# EasyEDA schematic optiDrive_Shematic.json
TITLE: STM32 Blue Pill closed stepper controller; REV: 0.1; Date: 2021-12-12; Sheet: 1/1
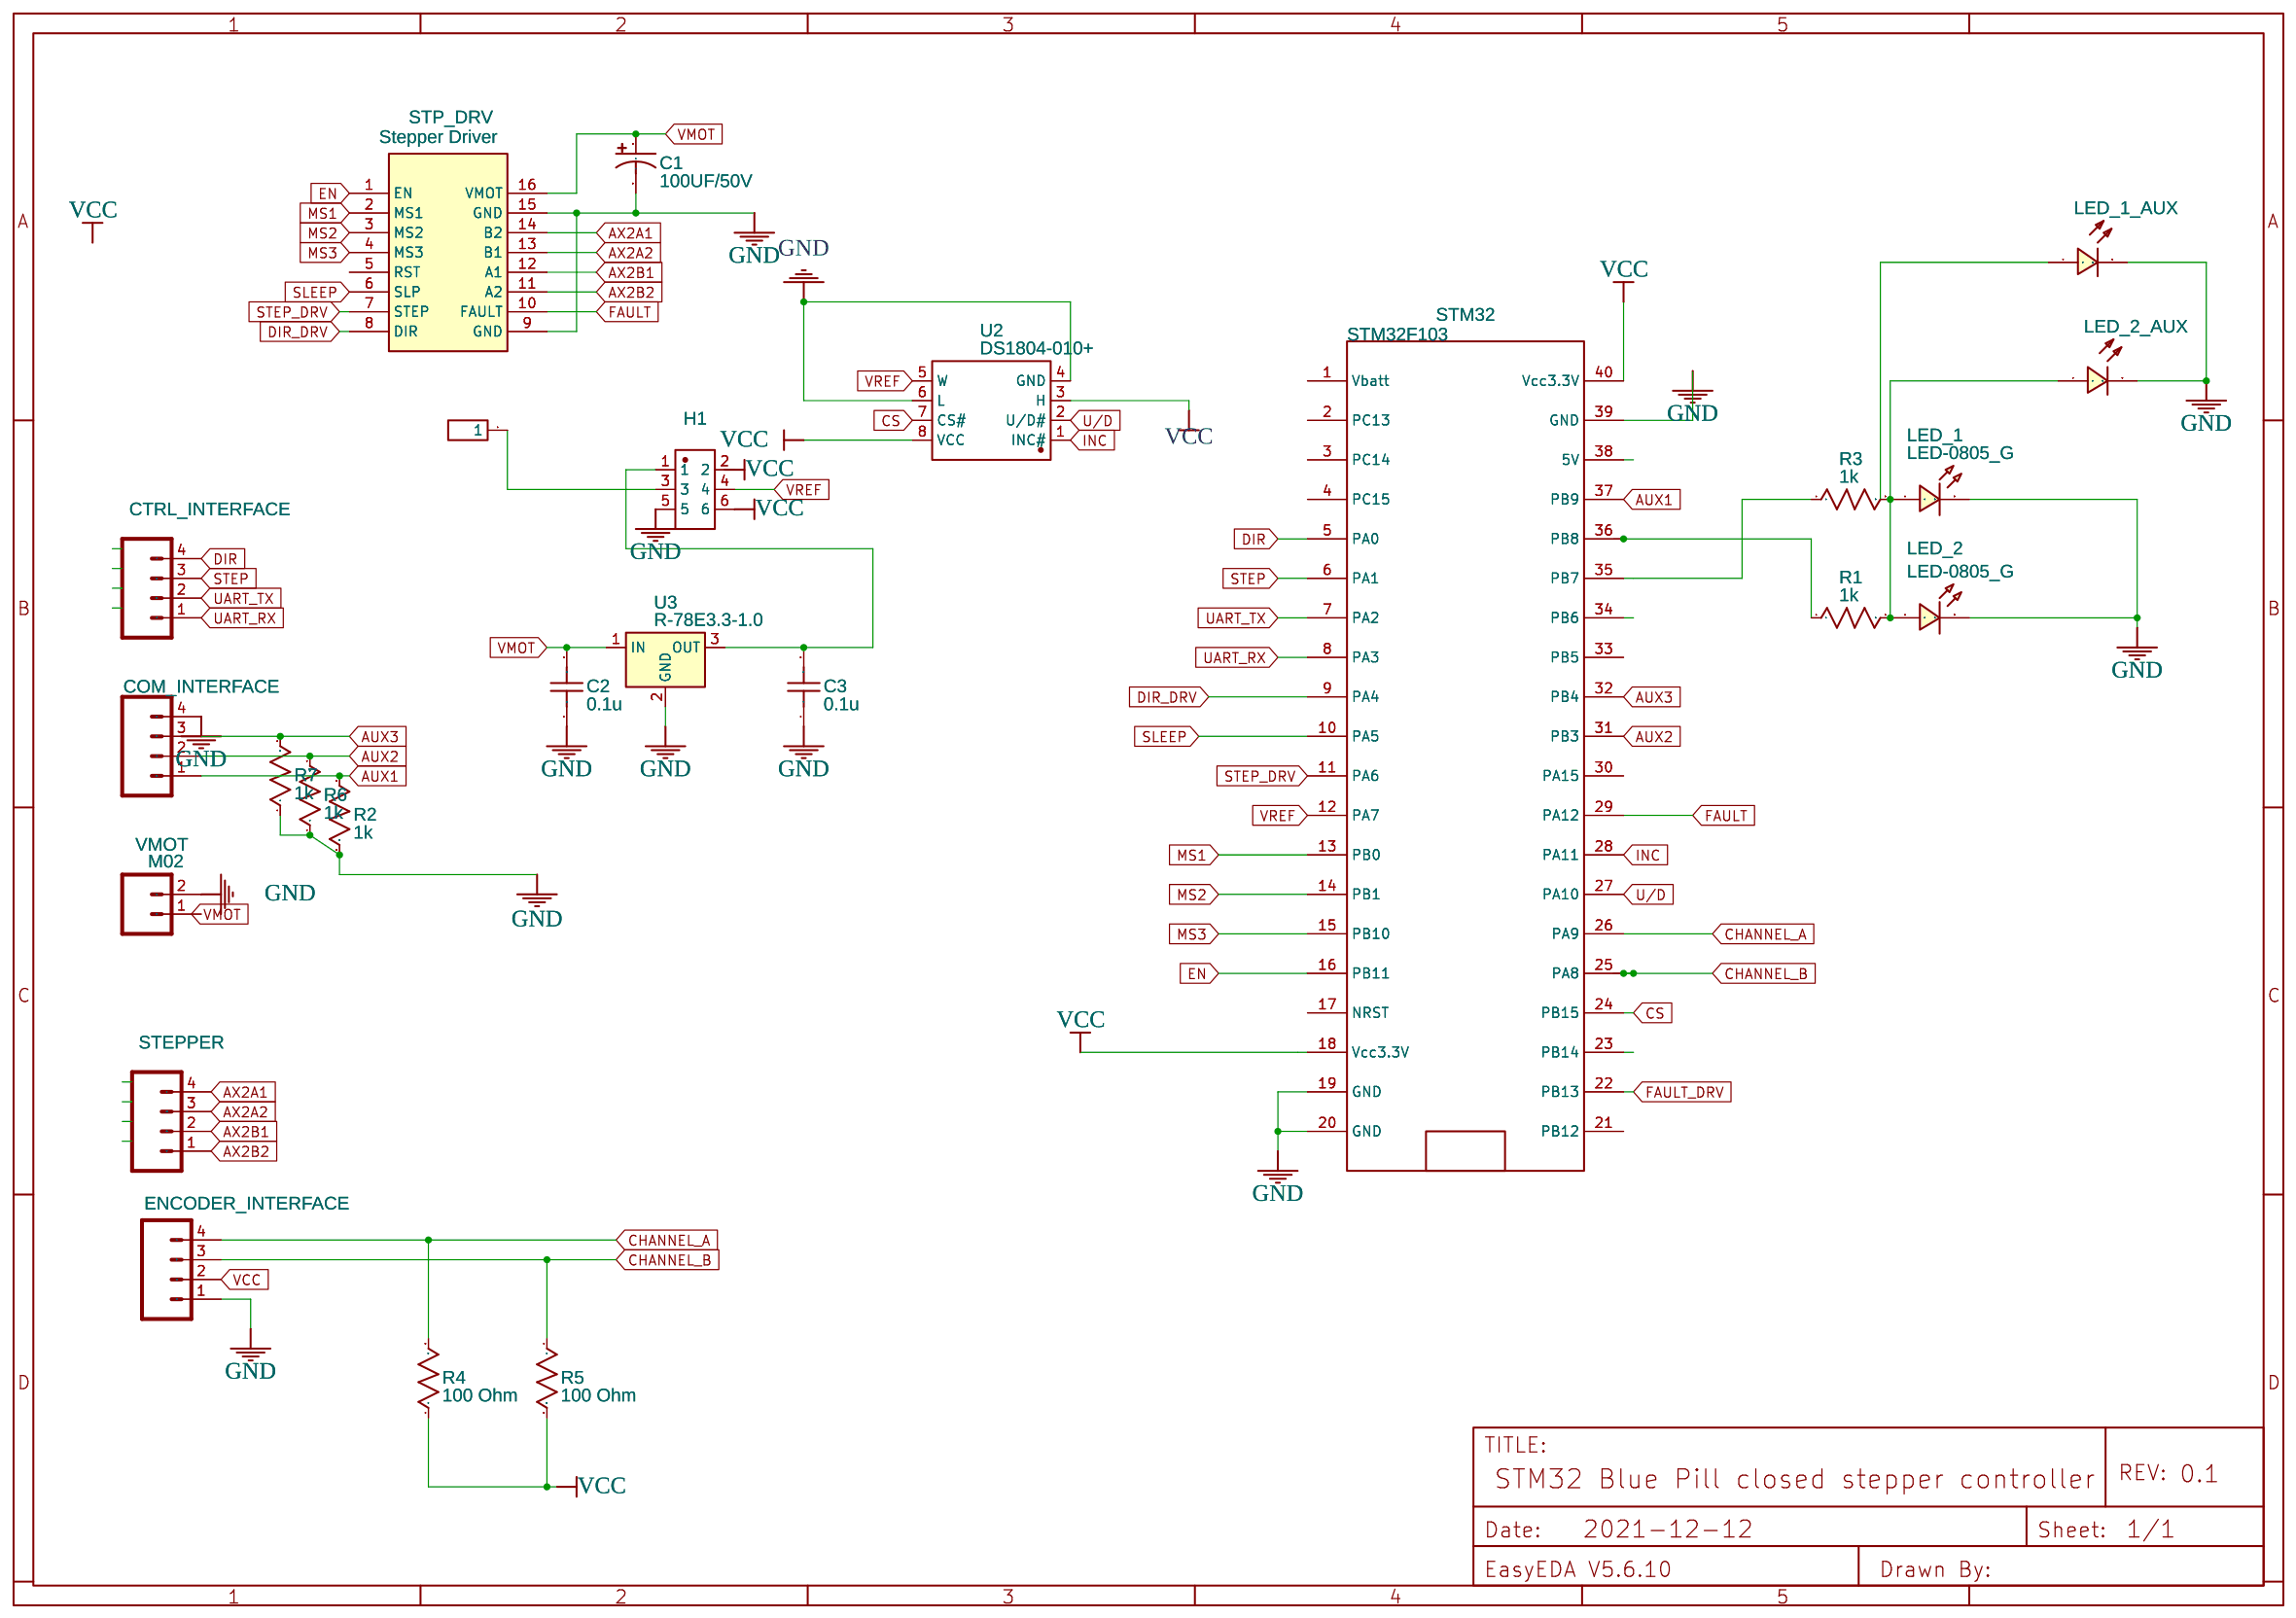
[diagram p0: schematic sheet]

## Parts
C1  100UF/50V  [CAP  8MM]
C2  0.1u  [CAP-TH_L5.3-W2.5-P4.00-D0.5]
C3  0.1u  [CAP-TH_L5.3-W2.5-P4.00-D0.5]
COM_IF  COM_INTERFACE  [MOLEX-1X4]
CTR_IF  CTRL_INTERFACE  [MOLEX-1X4]
ENC_IF  ENCODER_INTERFACE  [MOLEX-1X4]
H1  Connector  [HDR-TH_6P-P2.54-V-M-R2-C3-S2.54-3]
J1  Connect to VREF  [HDR-M-2.54_1X1]
LED_1  LED-0805_G  [LED0805_GREEN]
LED_2  LED-0805_G  [LED0805_GREEN]
NO  LED_1_AUX  [LED-TH_LED-3MM_RED]
NO#2  LED_2_AUX  [LED-TH_LED-3MM_RED]
R1  1k  [R_AXIAL-0.3]
R2  1k  [R_AXIAL-0.3]
R3  1k  [R_AXIAL-0.3]
R4  100 Ohm  [R_AXIAL-0.3]
R5  100 Ohm  [R_AXIAL-0.3]
R6  1k  [R_AXIAL-0.3]
R7  1k  [R_AXIAL-0.3]
STM32  STM32F103  [STM32F103C8T6-BLUEPILL]
STP  STEPPER  [MOLEX-1X4]
STP_DRV  Stepper Driver  [DRV8825 STEPPER MOTOR DRIVER CARRIER]
U2  DS1804-010+  [PDIP-8_L9.5-W6.6-P2.54-LS8.0-BL]
U3  R-78E3.3-1.0  [CONVERTER_DCDC_RECOM_R-78E-0.5_THT]
VMOT  M02  [MOLEX-1X2]

## Library data of the parts
C1 = 100UF/50V: CAP-07890; Contributor: SparkFun; sourceId: 6c97tPN9v
C2 C3 = C_0603_US: Contributor: LCEDA_Lib
COM_IF CTR_IF ENC_IF STP = M04: Contributor: SparkFun; Supplier: RS-Online
H1 = PZ254-2-03-W-8.5: Supplier: LCSC; Supplier Part: C2894983; Manufacturer: HCTL(华灿天禄); Contributor: LCSC; JLCPCB Part Class: Extended Part
J1 = HDR-M-2.54_1x1: Supplier Part: C81276; Supplier: RS-Online; Contributor: LCEDA_Lib
LED_1 LED_2 = LED-0805_G: Manufacturer: 国星光电; Manufacturer Part: NCD0805G1; Supplier Part: C84260; Supplier: RS-Online; Contributor: LCEDA_Lib
NO NO#2 = LED-3MM红: Supplier: LCSC; Supplier Part: C9900003389; Manufacturer Part: LED-3mm红; link: https://img.jlc.com/pdf/applyPasteComponent/2021-12-06/748033A/127ffe71aa84443fa05d6ffed81d0b6e/LED-3mm.pdf; Contributor: LCSC; JLCPCB Part Class: Extended Part
R1 R3-R5 = R_0603_US: Supplier: RS-Online; Contributor: LCEDA_Lib
R2 R6 R7 = R_AXIAL-0.3_US: Contributor: LCEDA_Lib
STM32 = STM32F103C8T6 Generic Development Board: Manufacturer Part: STM32Duino; Contributor: zsteva
STP_DRV = DRV8825 Stepper Motor Driver Carrier: Contributor: winter2015; sourceId: YsmgyP7pj; Package Display: No
U2 = DS1804-010+: Supplier: LCSC; Supplier Part: C1520917; Manufacturer: MAXIM(美信); Contributor: LCSC
U3 = R-78E3.3-1.0: Contributor: JuanChavarri
VMOT = M02: Contributor: SparkFun

## Nets
GND: C1.2(-) C2.1 C3.1 COM_IF.4 ENC_IF.1 H1.5 LED_1.2 LED_2.2 NO.2 NO#2.2 R2.1 R6.1 R7.1 STM32.19(GND) STM32.20(GND) STM32.39(GND) STP_DRV.9(GND) STP_DRV.15(GND) U2.4(GND) U2.6(L) U3.2(GND) VMOT.2
VCC: ENC_IF.2 H1.6 R4.1 R5.2 STM32.18(Vcc3.3V) STM32.40(Vcc3.3V) U2.3(H) U2.8(VCC)
AUX1: COM_IF.1 R2.2 STM32.37(PB9)
AUX2: COM_IF.2 R6.2 STM32.31(PB3)
AUX3: COM_IF.3 R7.2 STM32.32(PB4)
AX2A1: STP.4 STP_DRV.14(B2)
AX2A2: STP.3 STP_DRV.13(B1)
AX2B1: STP.2 STP_DRV.12(A1)
AX2B2: STP.1 STP_DRV.11(A2)
CHANNEL_A: ENC_IF.4 R4.2 STM32.26(PA9)
CHANNEL_B: ENC_IF.3 R5.1 STM32.25(PA8)
CS: STM32.24(PB15) U2.7(CS#)
DIR: CTR_IF.4 STM32.5(PA0)
DIR_DRV: STM32.9(PA4) STP_DRV.8(DIR)
EN: STM32.16(PB11) STP_DRV.1(EN)
FAULT: STM32.29(PA12) STP_DRV.10(FAULT)
FAULT_DRV: STM32.22(PB13)
INC: STM32.28(PA11) U2.1(INC#)
MS1: STM32.13(PB0) STP_DRV.2(MS1)
MS2: STM32.14(PB1) STP_DRV.3(MS2)
MS3: STM32.15(PB10) STP_DRV.4(MS3)
SLEEP: STM32.10(PA5) STP_DRV.6(SLP)
STEP: CTR_IF.3 STM32.6(PA1)
STEP_DRV: STM32.11(PA6) STP_DRV.7(STEP)
U/D: STM32.27(PA10) U2.2(U/D#)
UART_RX: CTR_IF.1 STM32.8(PA3)
UART_TX: CTR_IF.2 STM32.7(PA2)
VMOT: C1.1(+) C2.2 STP_DRV.16(VMOT) U3.1(IN)
VREF: H1.4 STM32.12(PA7) U2.5(W)
Net-(C3-2): C3.2 H1.1 U3.3(OUT)
Net-(H1-3): H1.3 J1.1
Net-(LED_1-1): LED_1.1 LED_2.1 NO#2.1 R1.2 R3.2
Net-(R1-1): R1.1 STM32.36(PB8)
Net-(R3-1): R3.1 STM32.35(PB7)

Not connected (* = marked no-connect by the designer): H1 2; NO 1; STM32 1(Vbatt) 2(PC13) 3(PC14) 4(PC15) 17(NRST) 21(PB12) 23(PB14) 30(PA15) 33(PB5) 34(PB6) 38(5V); STP_DRV 5(RST); VMOT 1
